# Altium project bmb_extender.PrjPcb
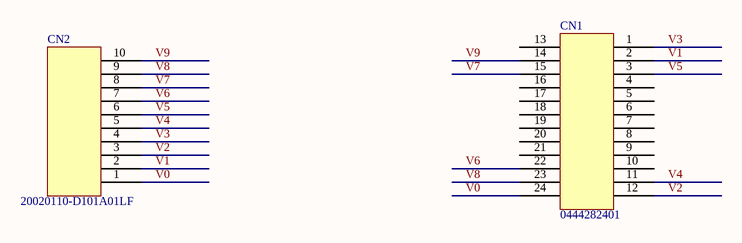
[diagram p0: bmb_extender.SchDoc]
1 sheet, 2 parts. Net scope: global (net labels, ports and power ports of the same name join across sheets).
Board file: bmb_extender.PcbDoc

## Sheet bmb_extender.SchDoc
size Tabloid

### Parts
CN1  0444282401  [MOLEX_0444282401]
CN2  20020110-D101A01LF

### Nets
V0: CN1.24 CN2.1
V1: CN1.2 CN2.2
V2: CN1.12 CN2.3
V3: CN1.1 CN2.4
V4: CN1.11 CN2.5
V5: CN1.3 CN2.6
V6: CN1.22 CN2.7
V7: CN1.15 CN2.8
V8: CN1.23 CN2.9
V9: CN1.14 CN2.10

Not connected (* = marked no-connect by the designer): CN1 4 5 6 7 8 9 10 13 16 17 18 19 20 21

### Library data of the parts
CN2 = SIL10